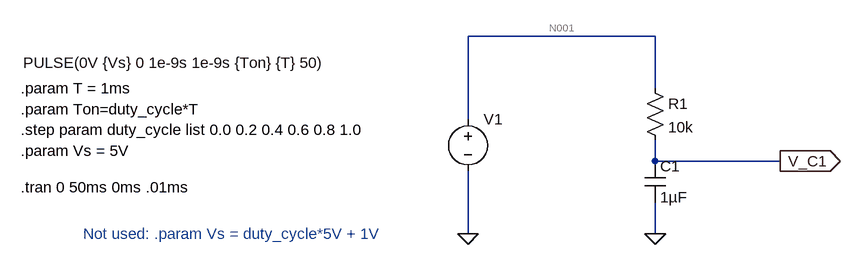
[diagram p0: schematic RC-lowpass_PWM_V001.asc]
RC-lowpass_PWM_V001.asc, the LTspice schematic file:
Version 4
SHEET 1 880 680
WIRE 240 -16 -48 -16
WIRE 240 64 240 -16
WIRE -48 112 -48 -16
WIRE 240 176 240 144
WIRE 432 176 240 176
WIRE -48 288 -48 192
WIRE 240 288 240 240
FLAG 240 288 0
FLAG -48 288 0
FLAG 432 176 V_C1
IOPIN 432 176 Out
DATAFLAG 320 176 ""
SYMBOL cap 224 176 R0
SYMATTR InstName C1
SYMATTR Value 1µF
SYMBOL res 224 48 R0
SYMATTR InstName R1
SYMATTR Value 10k
SYMBOL voltage -48 96 R0
WINDOW 3 -684 -71 Left 2
WINDOW 123 0 0 Left 0
WINDOW 39 0 0 Left 0
SYMATTR Value PULSE(0V {Vs} 0 1e-9s 1e-9s {Ton} {T} 50)
SYMATTR InstName V1
TEXT -736 216 Left 2 !.tran 0 50ms 0ms .01ms
TEXT -736 64 Left 2 !.param T = 1ms
TEXT -736 96 Left 2 !.param Ton=duty_cycle*T
TEXT -736 128 Left 2 !.step param duty_cycle list 0.0 0.2 0.4 0.6 0.8 1.0
TEXT -736 160 Left 2 !.param Vs = 5V
TEXT -640 288 Left 2 ;Not used: .param Vs = duty_cycle*5V + 1V

The netlist it stands for:
* RC-lowpass_PWM_V001.asc
C1 V_C1 0 1µF
R1 N001 V_C1 10k
V1 N001 0 PULSE(0V {Vs} 0 1e-9s 1e-9s {Ton} {T} 50)
.tran 0 50ms 0ms .01ms
.param T = 1ms
.param Ton=duty_cycle*T
.step param duty_cycle list 0.0 0.2 0.4 0.6 0.8 1.0
.param Vs = 5V
* Not used: .param Vs = duty_cycle*5V + 1V
.backanno
.end

* Results of the author's LTspice run, read from the files saved beside the schematic
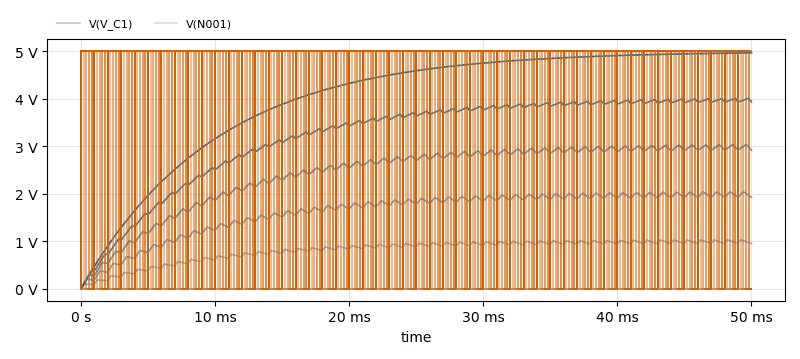
[diagram p1: Transient Analysis of RC-lowpass_PWM_V001.asc, plotted from the saved traces]
* Transient Analysis, 6 runs:
*   V(V_C1) [duty_cycle=0]: min 0 V, max 5.229 µV, average 4.071 µV, rms 4.242 µV, last 4.731 µV
*   V(V_C1) [duty_cycle=0.2]: min 0 V, max 1.033 V, average 809.5 mV, rms 844 mV, last 953.9 mV
*   V(V_C1) [duty_cycle=0.4]: min 0 V, max 2.046 V, average 1.615 V, rms 1.685 V, last 1.927 V
*   V(V_C1) [duty_cycle=0.6]: min 0 V, max 3.039 V, average 2.416 V, rms 2.523 V, last 2.92 V
*   V(V_C1) [duty_cycle=0.8]: min 0 V, max 4.012 V, average 3.213 V, rms 3.358 V, last 3.933 V
*   V(V_C1) [duty_cycle=1]: min 0 V, max 4.966 V, average 4.006 V, rms 4.191 V, last 4.966 V
*   V(N001) [duty_cycle=0]: min 0 V, max 5 V, average 5.003 µV, rms 5 mV, last 0 V
*   V(N001) [duty_cycle=0.2]: min 0 V, max 5 V, average 1 V, rms 2.236 V, last 0 V
*   V(N001) [duty_cycle=0.4]: min 0 V, max 5 V, average 2 V, rms 3.162 V, last 0 V
*   V(N001) [duty_cycle=0.6]: min 0 V, max 5 V, average 3 V, rms 3.873 V, last 0 V
*   V(N001) [duty_cycle=0.8]: min 0 V, max 5 V, average 4 V, rms 4.472 V, last 0 V
*   V(N001) [duty_cycle=1]: min 0 V, max 5 V, average 5 V, rms 5 V, last 5 V